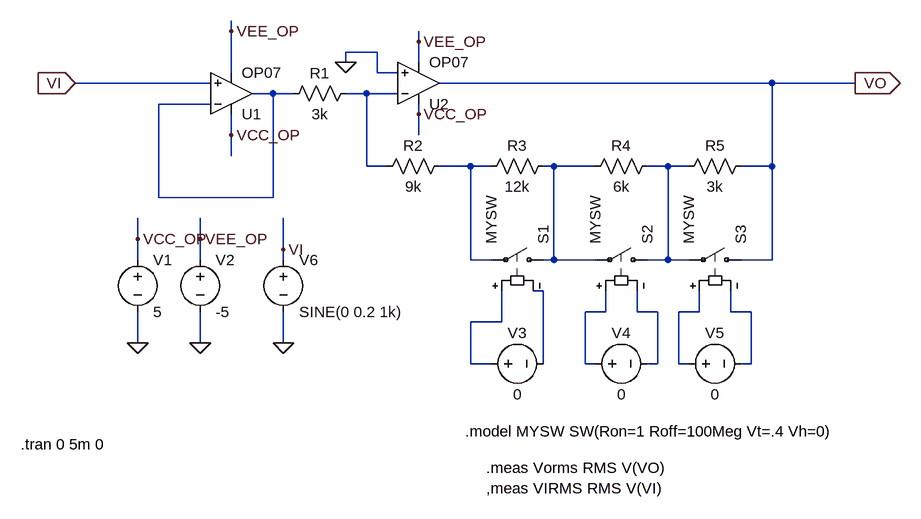
[diagram p0: schematic 1_3.asc]
1_3.asc, the LTspice schematic file:
Version 4
SHEET 1 1276 784
WIRE 192 64 192 48
WIRE 480 80 480 64
WIRE 416 96 368 96
WIRE 368 112 368 96
WIRE 480 112 480 80
WIRE 192 128 192 64
WIRE 416 128 416 96
WIRE 448 128 416 128
WIRE 160 144 -48 144
WIRE 1024 144 512 144
WIRE 1152 144 1024 144
WIRE 256 160 224 160
WIRE 288 160 256 160
WIRE 400 160 368 160
WIRE 448 160 400 160
WIRE 160 176 80 176
WIRE 480 192 480 176
WIRE 192 224 192 192
WIRE 480 224 480 192
WIRE 192 256 192 224
WIRE 400 272 400 160
WIRE 432 272 400 272
WIRE 560 272 512 272
WIRE 592 272 560 272
WIRE 688 272 672 272
WIRE 752 272 688 272
WIRE 864 272 832 272
WIRE 896 272 864 272
WIRE 1024 272 1024 144
WIRE 1024 272 976 272
WIRE 80 320 80 176
WIRE 256 320 256 160
WIRE 256 320 80 320
WIRE 48 384 48 352
WIRE 144 384 144 352
WIRE 272 400 272 352
WIRE 48 416 48 384
WIRE 144 416 144 384
WIRE 272 416 272 400
WIRE 560 416 560 272
WIRE 592 416 560 416
WIRE 688 416 688 272
WIRE 688 416 672 416
WIRE 752 416 688 416
WIRE 864 416 864 272
WIRE 864 416 832 416
WIRE 896 416 864 416
WIRE 1024 416 1024 272
WIRE 1024 416 976 416
WIRE 672 464 656 464
WIRE 768 496 768 464
WIRE 768 496 736 496
WIRE 816 496 816 464
WIRE 848 496 816 496
WIRE 912 496 912 464
WIRE 912 496 880 496
WIRE 960 496 960 464
WIRE 992 496 960 496
WIRE 608 512 608 464
WIRE 608 512 560 512
WIRE 48 544 48 496
WIRE 144 544 144 496
WIRE 272 544 272 496
WIRE 560 576 560 512
WIRE 592 576 560 576
WIRE 672 576 672 464
WIRE 736 576 736 496
WIRE 752 576 736 576
WIRE 848 576 848 496
WIRE 848 576 832 576
WIRE 880 576 880 496
WIRE 896 576 880 576
WIRE 992 576 992 496
WIRE 992 576 976 576
FLAG 368 112 0
FLAG -48 144 VI
IOPIN -48 144 In
FLAG 1152 144 VO
IOPIN 1152 144 Out
FLAG 144 544 0
FLAG 48 544 0
FLAG 48 384 VCC_OP
FLAG 144 384 VEE_OP
FLAG 272 544 0
FLAG 272 400 VI
FLAG 192 224 VCC_OP
FLAG 480 192 VCC_OP
FLAG 192 64 VEE_OP
FLAG 480 80 VEE_OP
SYMBOL res 384 144 R90
WINDOW 0 0 56 VBottom 2
WINDOW 3 32 56 VTop 2
SYMATTR InstName R1
SYMATTR Value 3k
SYMBOL OpAmps\\OP07 192 224 M180
SYMATTR InstName U1
SYMBOL OpAmps\\OP07 480 208 M180
SYMATTR InstName U2
SYMBOL res 528 256 R90
WINDOW 0 0 56 VBottom 2
WINDOW 3 32 56 VTop 2
SYMATTR InstName R2
SYMATTR Value 9k
SYMBOL res 688 256 R90
WINDOW 0 0 56 VBottom 2
WINDOW 3 32 56 VTop 2
SYMATTR InstName R3
SYMATTR Value 12k
SYMBOL res 848 256 R90
WINDOW 0 0 56 VBottom 2
WINDOW 3 32 56 VTop 2
SYMATTR InstName R4
SYMATTR Value 6k
SYMBOL res 992 256 R90
WINDOW 0 0 56 VBottom 2
WINDOW 3 32 56 VTop 2
SYMATTR InstName R5
SYMATTR Value 3k
SYMBOL sw 688 416 M270
SYMATTR InstName S1
SYMATTR Value MYSW
SYMBOL sw 848 416 M270
SYMATTR InstName S2
SYMATTR Value MYSW
SYMBOL sw 992 416 M270
SYMATTR InstName S3
SYMATTR Value MYSW
SYMBOL voltage 48 400 R0
WINDOW 123 0 0 Left 0
WINDOW 39 0 0 Left 0
SYMATTR InstName V1
SYMATTR Value 5
SYMBOL voltage 144 400 R0
WINDOW 123 0 0 Left 0
WINDOW 39 0 0 Left 0
SYMATTR InstName V2
SYMATTR Value -5
SYMBOL voltage 576 576 R270
WINDOW 0 32 56 VTop 2
WINDOW 3 -32 56 VBottom 2
WINDOW 123 0 0 Left 0
WINDOW 39 0 0 Left 0
SYMATTR InstName V3
SYMATTR Value 0
SYMBOL voltage 736 576 R270
WINDOW 0 32 56 VTop 2
WINDOW 3 -32 56 VBottom 2
WINDOW 123 0 0 Left 0
WINDOW 39 0 0 Left 0
SYMATTR InstName V4
SYMATTR Value 0
SYMBOL voltage 880 576 R270
WINDOW 0 32 56 VTop 2
WINDOW 3 -32 56 VBottom 2
WINDOW 123 0 0 Left 0
WINDOW 39 0 0 Left 0
SYMATTR InstName V5
SYMATTR Value 0
SYMBOL voltage 272 400 R0
WINDOW 123 0 0 Left 0
WINDOW 39 0 0 Left 0
SYMATTR InstName V6
SYMATTR Value SINE(0 0.2 1k)
TEXT 552 680 Left 2 !.model MYSW SW(Ron=1 Roff=100Meg Vt=.4 Vh=0)
TEXT -132 700 Left 2 !.tran 0 5m 0
TEXT 584 736 Left 2 !.meas Vorms RMS V(VO)
TEXT 584 768 Left 2 !,meas VIRMS RMS V(VI)

The netlist it stands for:
* 1_3.asc
R1 N002 N001 3k
XU1 VI N001 VCC_OP VEE_OP N001 LT1001  ; OP07, pins In+ In- V+ V- OUT
XU2 0 N002 VCC_OP VEE_OP VO LT1001  ; OP07, pins In+ In- V+ V- OUT
R2 N003 N002 9k
R3 N004 N003 12k
R4 N005 N004 6k
R5 VO N005 3k
S1 N004 N003 N011 N006 MYSW
S2 N005 N004 N007 N008 MYSW
S3 VO N005 N009 N010 MYSW
V1 VCC_OP 0 5
V2 VEE_OP 0 -5
V3 N011 N006 0
V4 N007 N008 0
V5 N009 N010 0
V6 VI 0 SINE(0 0.2 1k)
.model MYSW SW(Ron=1 Roff=100Meg Vt=.4 Vh=0)
.tran 0 5m 0
.meas Vorms RMS V(VO)
,meas VIRMS RMS V(VI)
.lib LTC.lib
.backanno
.end

* Results of the author's LTspice run, read from the files saved beside the schematic
* Operating Point, zero values left out:
*   V(vcc_op) = 5 V
*   V(vee_op) = -5 V
*   I(V2) = 4.5 mA
*   I(V1) = -4.5 mA
*   Ix(u1:3) = 2.25 mA
*   Ix(u1:4) = -2.25 mA
*   Ix(u2:3) = 2.25 mA
*   Ix(u2:4) = -2.25 mA
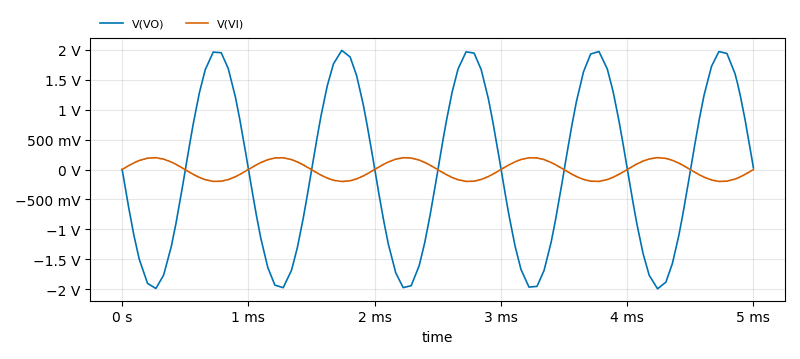
[diagram p1: Transient Analysis of 1_3.asc, plotted from the saved traces]
* Transient Analysis, 1 run:
*   V(VO): min -1.994 V, max 1.994 V, average 193.8 µV, rms 1.405 V, last 28.22 mV
*   V(VI): min -199.6 mV, max 199.6 mV, average -20.44 µV, rms 140.5 mV, last 0 V
* From the log:
*   vorms: RMS(v(vo))=1.41357 FROM 0 TO 0.005